# EAGLE design EARS (EAGLE 9.4.2)
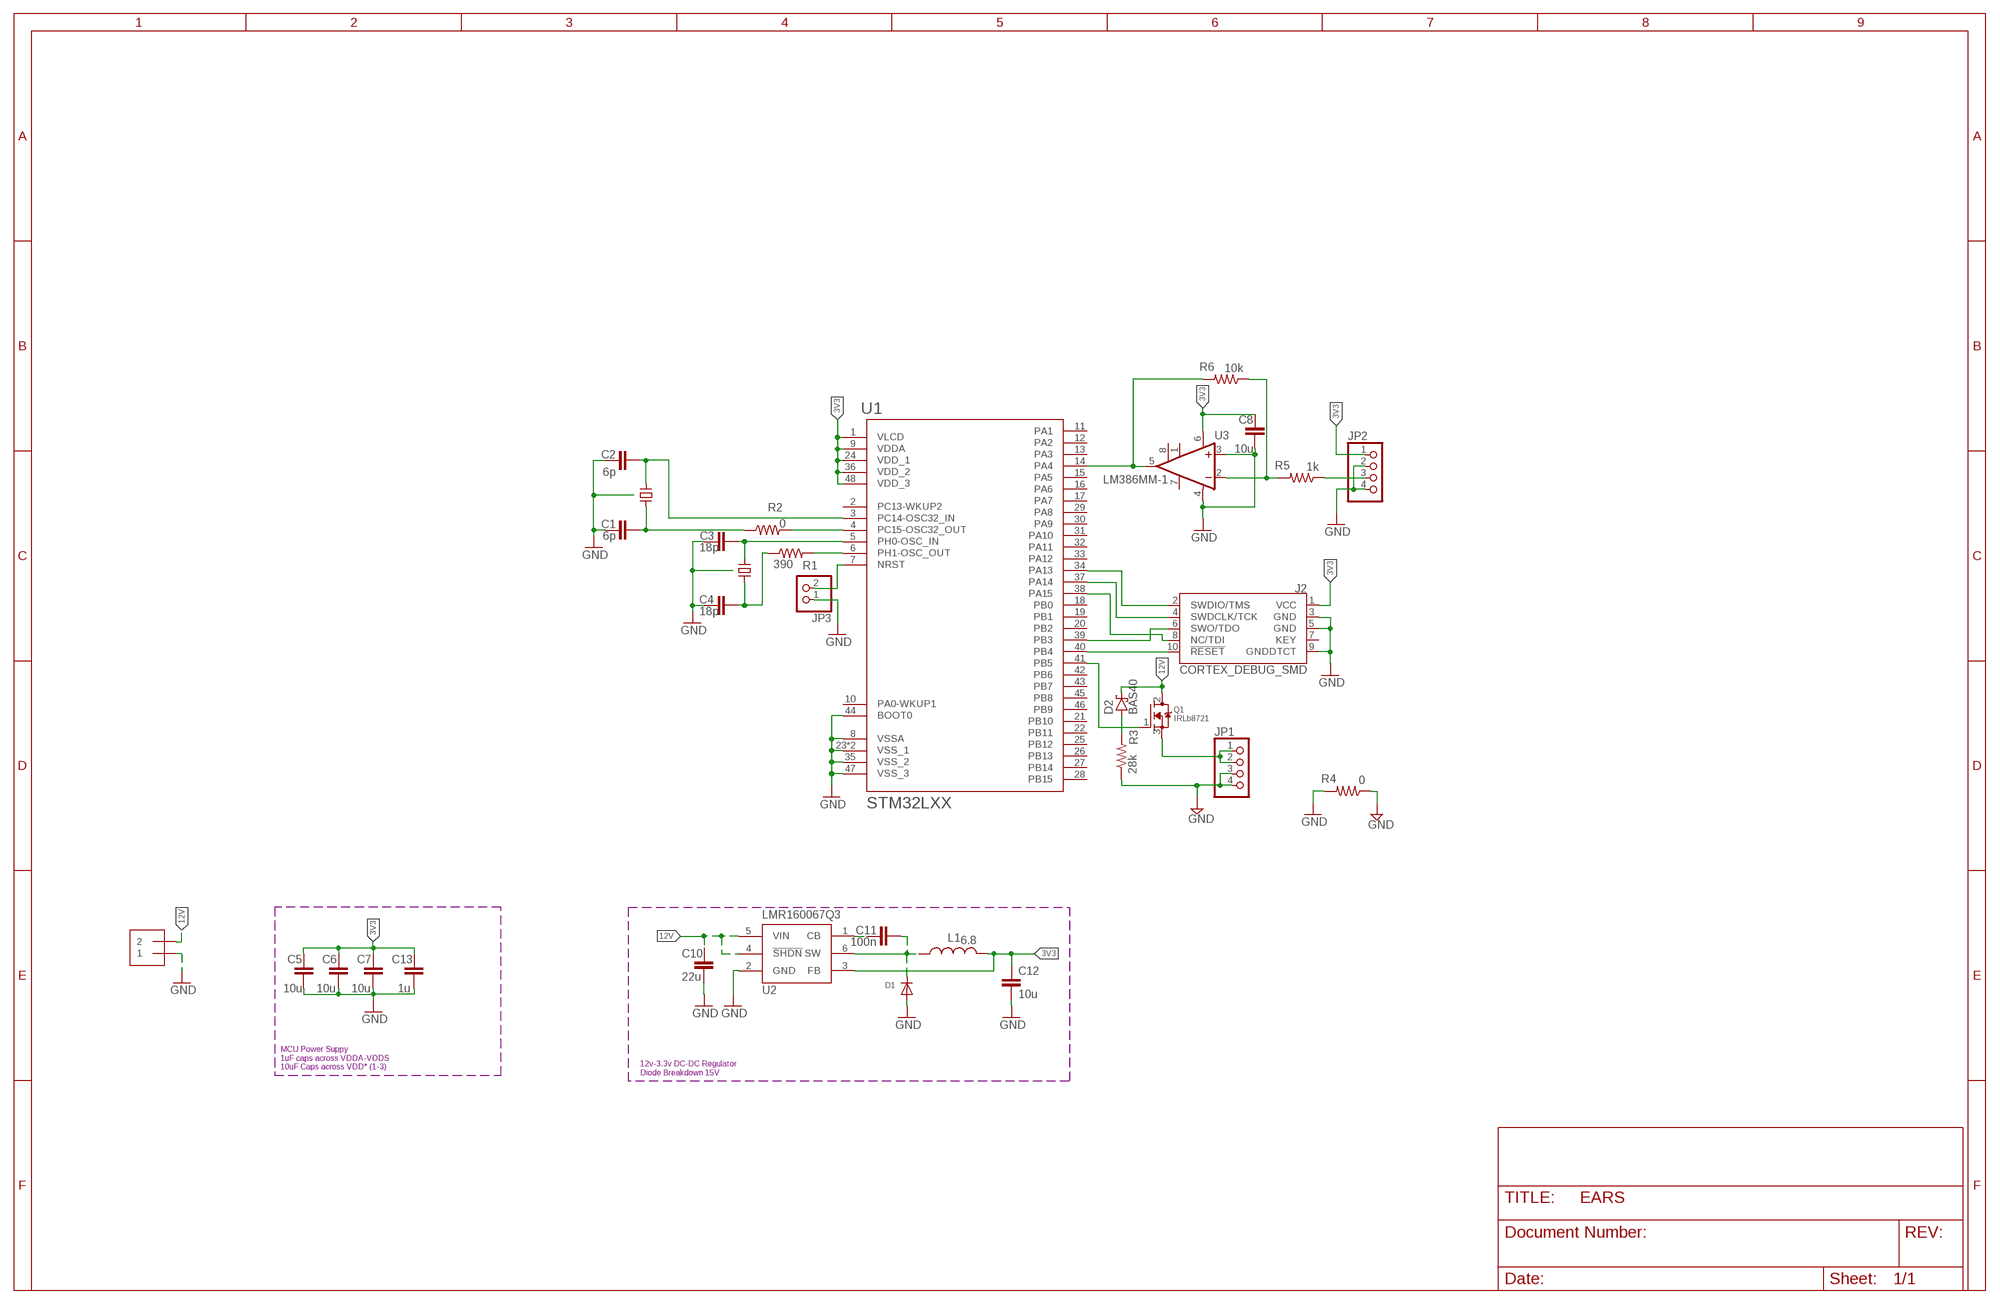
[diagram p0: schematic, sheet 1]

## Parts
C1  6p  C-EUC0603  [C0603]
C2  6p  C-EUC0603  [C0603]
C3  18p  C-EUC0603  [C0603]
C4  18p  C-EUC0603  [C0603]
C5  10u  C-EUC0603  [C0603]
C6  10u  C-EUC0603  [C0603]
C7  10u  C-EUC0603  [C0603]
C8  10u  C-EUC0603  [C0603]
C10  22u  C-EUC0603  [C0603]
C11  100n  C-EUC0603  [C0603]
C12  10u  C-EUC0603  [C0603]
C13  1u  C-EUC0603  [C0603]
D1  DIODESMA  [SMADIODE]
D2  BAS40  [SOT23]
J1  1X2-3.5MM  [1X2-3.5MM]
J2  CORTEX_DEBUG_SMD  [SAMTECH_FTSH-105-01]
JP1  PINHD-1X4  [1X04]
JP2  PINHD-1X4  [1X04]
JP3  PINHD-1X2  [1X02]
L1  6.8  L-USL3216C  [L3216C]
Q1  IRLb8721  MOSFET-NGDS_TO220V  [TO220V]
R1  390  R-US_R0603  [R0603]
R2  0  R-US_R0603  [R0603]
R3  28k  R-US_R0603  [R0603]
R4  0  R-US_R0603  [R0603]
R5  1k  R-US_R0603  [R0603]
R6  10k  R-US_R0603  [R0603]
U1  STM32LXX  [UFQFPN48]
U2  LMR160067Q3  [TI_SOT6]
U3  LM386MM-1  [MMSOP08]
X1  ECX_34G  [3.2X1.5_SC]
X2  FL0800011Q  [3.2X2.5_SSC]

## Nets
3V3: C5.2 C6.2 C7.2 C8.2 C12.1 C13.2 J2.1(VCC) JP2.1 L1.2 U1.1(VLCD) U1.9(VDDA) U1.24(VDD_1) U1.36(VDD_2) U1.48(VDD_3) U2.3(FB) U3.6(VS)
8M0X_OUT: C4.2 R1.1 X2.3(C2)
8MOX_IN: C3.2 U1.5(PH0-OSC_IN) X2.1(C1)
12V: C10.2 D2.3(C) J1.2 Q1.2(D) U2.4(!SHDN!) U2.5(VIN)
!RESET!: J2.10(!RESET) U1.40(PB4)
AGND: JP1.3 JP1.4 R3.1 R4.1 ; supply symbol labelled GND
FB: R5.2 R6.1 U3.2(-IN)
FLYBACK: D2.1(A) R3.2
GND: C1.1 C2.1 C3.1 C4.1 C5.1 C6.1 C7.1 C8.1 C10.1 C12.2 C13.1 D1.A J1.1 J2.3(GND) J2.5(GND) J2.9(GNDDTCT) JP2.2 JP2.4 JP3.1 R4.2 U1.8(VSSA) U1.23(VSS_1) U1.35(VSS_2) U1.44(BOOT0) U1.47(VSS_3) U1.T1(VSS_1) U2.2(GND) U3.3(+IN) U3.4(GND) X1.GND X2.2 X2.4
LMR_CB: C11.1 U2.1(CB)
LMR_SW: C11.2 D1.C L1.1 U2.6(SW)
MCU_P4: R2.2 U1.4(PC15-OSC32_OUT)
MCU_P6: R1.2 U1.6(PH1-OSC_OUT)
NC: J2.8(NC/TDI) U1.38(PA15)
NPN: JP1.1 JP1.2 Q1.3(S)
NPN_DRV: Q1.1(G) U1.41(PB5)
NRST: JP3.2 U1.7(NRST)
OSC32_IN: C1.2 R2.1 X1.C2
OSC32_OUT: C2.2 U1.3(PC14-OSC32_IN) X1.C1
PRESSURE: R6.2 U1.14(PA4) U3.5(OUT)
PRSR_IN: JP2.3 R5.1
SWDCLK: J2.4(SWDCLK/TCK) U1.37(PA14)
SWDIO: J2.2(SWDIO/TMS) U1.34(PA13)
SWO: J2.6(SWO/TDO) U1.39(PB3)
Unconnected: J2.7(KEY) U1.2(PC13-WKUP2) U1.10(PA0-WKUP1) U1.11(PA1) U1.12(PA2) U1.13(PA3) U1.15(PA5) U1.16(PA6) U1.17(PA7) U1.18(PB0) U1.19(PB1) U1.20(PB2) U1.21(PB10) U1.22(PB11) U1.25(PB12) U1.26(PB13) U1.27(PB14) U1.28(PB15) U1.29(PA8) U1.30(PA9) U1.31(PA10) U1.32(PA11) U1.33(PA12) U1.42(PB6) U1.43(PB7) U1.45(PB8) U1.46(PB9) U3.1(GAIN) U3.7(BYPASS) U3.8(GAIN)

## Notes on the sheet
- MCU Power Suppy
  1uF caps across VDDA-VDDS
  10uF Caps across VDD* (1-3)
- 12v-3.3v DC-DC Regulator
  Diode Breakdown 15V

## Library data of the parts
C1-C8 C10-C13 = rcl:C-EU: CAPACITOR, European symbol; SPICEPREFIX: C
D1 = adafruit:DIODE: Diode SMADIODE - SMA Surface Mount Package 20V 1A Schottky Diode Digikey: 641-1014-6-ND DO-1N4148 - Through Hole Small Current Diode SOD-123 20V 1 A (.5mV Vf) Schottky Diode - Digikey: MBRX120TPMSCT-ND SOD-323 10V 570mA (.38mV Vf, 3ns) Schottky Diode - Digikey: ZLLS410CT-ND SOD-523 30V 30mA Schottky Diode (RB751S-40TE61) - Digikey: RB751S-40TE61CT-ND SOT23-R/W - SOT23 Package (R = Solder Paste/Reflow Ovens, W = Hand-Soldering) BAT54Film 40V 300mA - Digikey: 497-7162-1-ND
D2 = diode:BAS40: Silicon Schottky Diodes General-purpose diode for high-speed switching
J1 = adafruit:1X2: 3.5mm Terminal block http://www.ladyada.net/library/pcb/eaglelibrary.html
J2 = SparkFun-Connectors:CORTEX_DEBUG: Cortex Debug Connector - 10 pin Supports JTAG debug, Serial Wire debug, and Serial Wire Viewer. PTH and SMD connector options available. General Connector Information <http://infocenter.arm.com/help/topic/com.arm.doc.faqs/attached/13634/cortex_debug_connectors.pdf> Products: PTH Connector <http://www.digikey.com/product-detail/en/cnc-tech/3220-10-0100-00/1175-1627-ND/3883661> -via Digi-Key SparkFun PSoc <https://www.sparkfun.com/products/13229> SparkFun T <https://www.sparkfun.com/products/13810>
JP1 JP2 = pinhead:PINHD-1X4: PIN HEADER
JP3 = pinhead:PINHD-1X2: PIN HEADER
L1 = rcl:L-US: INDUCTOR, American symbol; SPICEPREFIX: L
Q1 = adafruit:MOSFET-N: N-Channel Mosfet 2N7002E - 60V 260mA SOT23 [Digikey: 2N7002ET1GOSTR-ND] - REEL BSH103 - 30V 850mA SOT23 [Digikey: 568-5013-1-ND]
R1-R6 = rcl:R-US_: RESISTOR, American symbol; SPICEPREFIX: R
U1 = EARS:STM32LXX
U2 = EARS:LMR160067Q3
U3 = linear:LM386?-*: Low Voltage Audio Power Amplifier Source: http://cache.national.com/ds/LM/LM386.pdf
X1 = EARS:ECX_34G
X2 = EARS:FL0800011Q

## Board
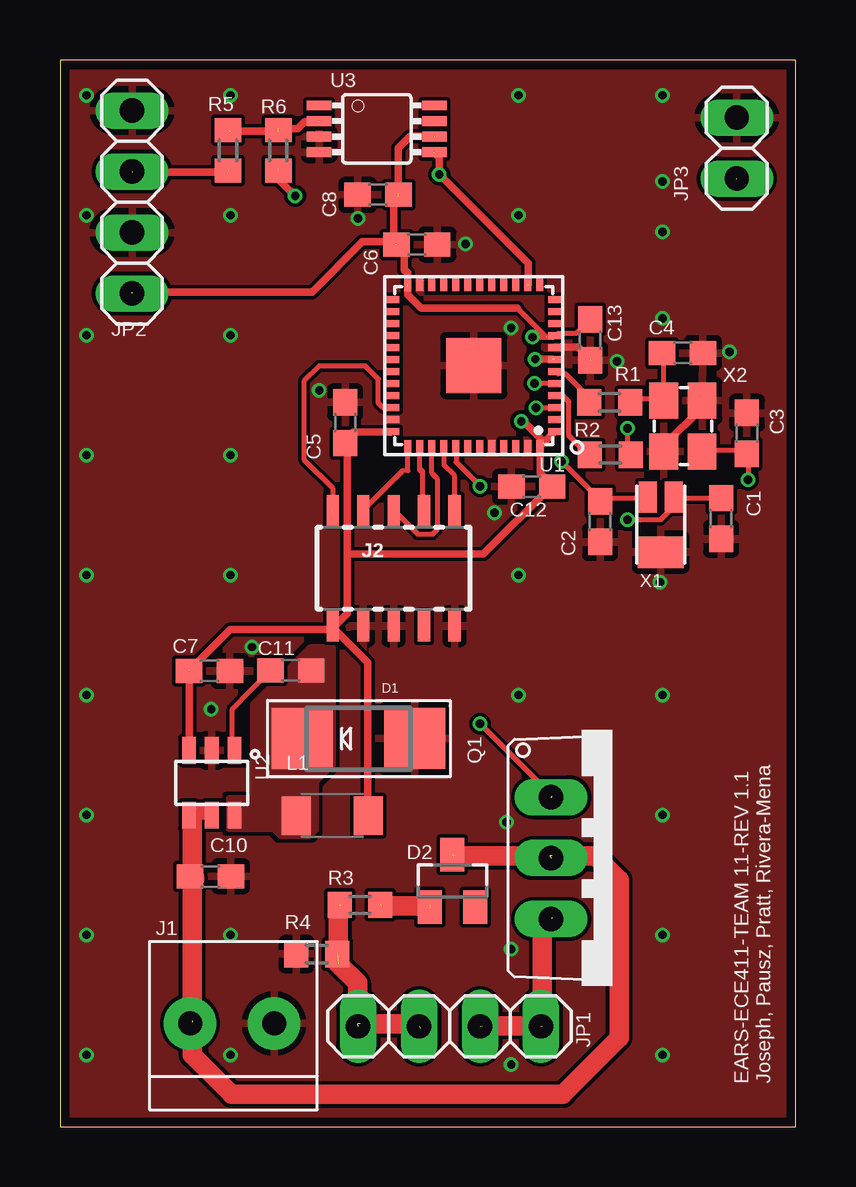
[diagram p1: board, top side]
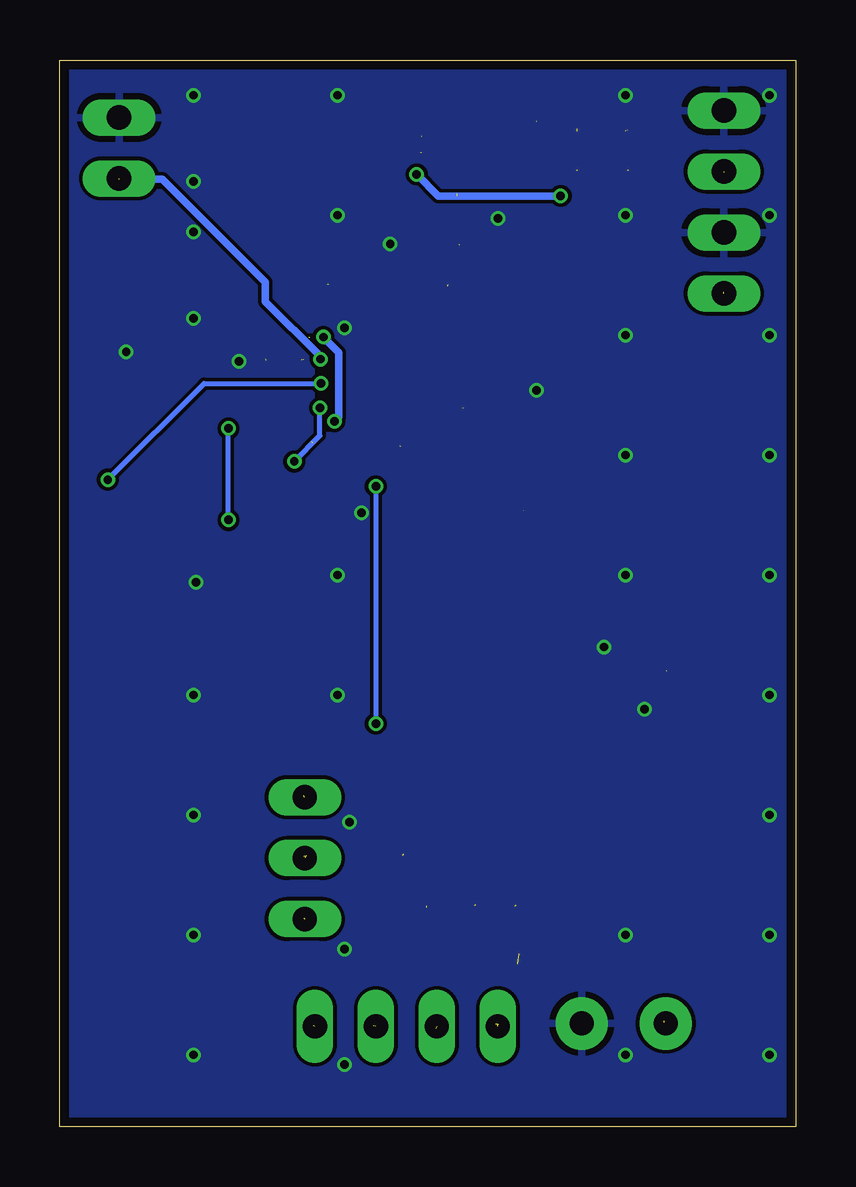
[diagram p2: board, bottom side, seen from below]

Size 30.66 x 44.47 mm. Coordinates in mm from the lower left corner, seen from the top.
Outline: 0,0 30.66,0 30.66,44.47 0,44.47 0,0
Copper layers (1*16): Top 0.035559375mm / dielectric 1.6mm / Bottom 0.035559375mm
Design rules "oshpark2layer": minimum track width 6mil, minimum drill 10mil, track to track 6mil, track to pad 6mil, pad to pad 6mil, via to via 6mil, smd to smd 6mil, copper to edge 15mil, drill to drill 6mil, minimum pad ring 5mil, minimum via ring 5mil, stop-mask expansion 2.5mil, vias tented up to drill 0mil, thermal gap 10mil

### Footprints (pad centres in the part's own frame; a part is rotated, then mirrored left to right if it is on the bottom)
C0603 = smd 1.1 x 1: 1 -0.85,0; 2 0.85,0
SMADIODE = smd 2.54 x 2.54: A 2.349,0; C -2.349,0
SOT23 = smd 1 x 1.4: 1 -0.95,-1.1; 2 0.95,-1.1; 3 0,1.1
1X2-3.5MM = drill 1 pad 2.184: 1 1.8,0; 2 -1.7,0
SAMTECH_FTSH-105-01 = smd 0.508 x 1.27: 1 -2.54,-2.413; 2 -2.54,2.413; 3 -1.27,-2.413; 4 -1.27,2.413; 5 0,-2.413; 6 0,2.413; 7 1.27,-2.413; 8 1.27,2.413; 9 2.54,-2.413; 10 2.54,2.413
1X04 = drill 1.016 long: 1 -3.81,0; 2 -1.27,0; 3 1.27,0; 4 3.81,0
1X02 = drill 1.016 long: 1 -1.27,0; 2 1.27,0
L3216C = smd 1.2 x 1.6: 1 -1.5,0; 2 1.5,0
TO220V = drill 1.016 long: 1 -2.54,-2.54; 2 0,-2.54; 3 2.54,-2.54
R0603 = smd 1 x 1.1: 1 -0.85,0; 2 0.85,0
UFQFPN48 = smd 0.55 x 0.3: 1 -3.375,2.75; 2 -3.375,2.25; 3 -3.375,1.75; 4 -3.375,1.25; 5 -3.375,0.75; 6 -3.375,0.25; 7 -3.375,-0.25; 8 -3.375,-0.75; 9 -3.375,-1.25; 10 -3.375,-1.75; 11 -3.375,-2.25; 12 -3.375,-2.75; 25 3.375,-2.75; 26 3.375,-2.25; 27 3.375,-1.75; 28 3.375,-1.25; 29 3.375,-0.75; 30 3.375,-0.25; 31 3.375,0.25; 32 3.375,0.75; 33 3.375,1.25; 34 3.375,1.75; 35 3.375,2.25; 36 3.375,2.75 | smd 0.3 x 0.55: 13 -2.75,-3.375; 14 -2.25,-3.375; 15 -1.75,-3.375; 16 -1.25,-3.375; 17 -0.75,-3.375; 18 -0.25,-3.375; 19 0.25,-3.375; 20 0.75,-3.375; 21 1.25,-3.375; 22 1.75,-3.375; 23 2.25,-3.375; 24 2.75,-3.375; 37 2.75,3.375; 38 2.25,3.375; 39 1.75,3.375; 40 1.25,3.375; 41 0.75,3.375; 42 0.25,3.375; 43 -0.25,3.375; 44 -0.75,3.375; 45 -1.25,3.375; 46 -1.75,3.375; 47 -2.25,3.375; 48 -2.75,3.375 | smd 2.3 x 2.3: T1 0,0
TI_SOT6 = smd 1.1 x 0.6: 1 -1.35,0.95; 2 -1.35,0; 3 -1.35,-0.95; 4 1.35,-0.95; 5 1.35,0; 6 1.35,0.95
MMSOP08 = smd 0.41 x 1.02: 1 -0.975,-2.4; 2 -0.325,-2.4; 3 0.325,-2.4; 4 0.975,-2.4; 5 0.975,2.4; 6 0.325,2.4; 7 -0.325,2.4; 8 -0.975,2.4
3.2X1.5_SC = smd 1.3 x 0.75: C1 -1.15,-0.55; C2 -1.15,0.55 | smd 1.3 x 1.9: GND 1.15,0
3.2X2.5_SSC = smd 1.5 x 1.2: 1 -1.06,-0.8; 2 1.06,-0.8; 3 1.06,0.8; 4 -1.06,0.8

### Placement (x,y rotation side)
C1  27.55,25.36 90 top
C2  22.51,25.23 90 top
C3  28.62,28.91 270 top
C4  25.94,32.26 180 top
C5  11.88,29.35 270 top
C6  14.87,36.78 180 top
C7  6.23,19.01 180 top
C8  13.25,38.85 0 top
C10  6.27,10.44 180 top
C11  9.62,19.02 0 top
C12  19.66,26.68 180 top
C13  22.09,32.8 90 top
D1  12.44,16.18 0 top
D2  16.35,10.25 0 top
J1  7.12,4.31 0 top
J2  13.9,23.28 0 top
JP1  16.23,4.19 180 top
JP2  3,38.55 90 top
JP3  28.2,40.8 270 top
L1  11.34,12.97 0 top
Q1  23,11.2 270 top
R1  22.9,30.2 180 top
R2  22.93,28.02 180 top
R3  12.5,9.25 0 top
R4  10.7,7.2 180 top
R5  7,40.7 90 top
R6  9.1,40.7 270 top
U1  17.24,31.73 180 top
U2  6.32,14.34 270 top
U3  13.2,41.6 270 top
X1  25.03,25.1 270 top
X2  25.95,29.21 90 top

### Tracks (layer width: path | path; a pad name or v marks a point on that pad's centre or on a via)
3V3  (via drill 0.35)  (9 unrouted)
  Top 0.152: 14.34,36.42 14.04,36.73 C6.2 | 21.96,33.53 C13.2 | 20.59,28.96 U1.1 | 20.01,28.35 U1.48 | 20.44,26.82 C12.1 20.44,26.67 | 20.59,32.92 U1.9 | 13.79,28.97 U1.36 | 11.91,28.65 C5.2 | 5.38,15.69 U2.3 | 11.3,20.73 J2.1 | 11.45,20.88 J2.1 | 12.82,13.11 L1.2 | 11.45,20.73 J2.1
  Top 0.203: 21.96,33.53 21.51,33.07 20.75,33.07 U1.9 | v19.69,32.92 20.26,32.92 19.06,34.12 | 20.29,32.92 20.59,32.92
  Top 0.305: 14.34,36.42 14.34,35.7 14.49,35.6 U1.24 | 20.59,28.96 20.18,28.54 19.3,29.42 v19.22,29.42 | 20.01,28.35 20.01,27.26 20.44,26.82 | 20.14,28.5 U1.48 | 14.5,35.05 14.5,34.69 15.06,34.12 19.06,34.12 | 13.79,28.97 12.22,28.97 11.91,28.65 | 5.38,15.69 C7.2 7.1,20.73 11.3,20.73 | 11.97,23.87 11.97,21.4 11.45,20.88 | 11.97,23.87 11.97,28.5 C5.2 | 12.82,13.11 12.82,19.36 11.45,20.73 | 20.44,26.67 17.64,23.87 11.97,23.87 | 14.1,38.9 14.1,40.8 14.6,41.3 15.6,41.3 | 3,34.8 10.5,34.8 12.6,36.9 13.9,36.9 | 13.9,36.9 14,36.8 | 14.1,38.8 13.9,38.6 13.9,36.9
  Bottom 0.305: v19.69,32.92 19.05,32.28 19.05,29.59 v19.22,29.42
8M0X_OUT
  Top 0.152: 25.01,30.33 X2.3 25.16,30.33
  Top 0.203: 25.01,30.33 23.79,30.33 R1.1 | 25.16,30.33 25.16,32.16 C4.2
8MOX_IN  (via drill 0.35)
  Top 0.152: U1.5 | 28.67,28.04 C3.2 28.52,28.19 | 26.84,28.19 X2.1
  Top 0.203: U1.5 v19.78,30.99 | 28.67,28.04 v28.67,26.98 | 28.52,28.19 26.84,28.19
  Bottom 0.203: v19.78,30.99 24.66,30.99 v28.67,26.98
12V  (4 unrouted)
  Top 0.152: 5.5,13.11 U2.4 5.5,12.95 | 6.27,13.11 U2.5 | 5.5,10.52 C10.2 | 5.5,4.42 J1.2
  Top 0.61: 6.27,13.11 5.5,13.11
  Top 0.813: 5.5,12.95 5.5,10.52 | 5.5,4.42 5.5,10.36 | 5.5,4.35 5.5,3 7.15,1.35 20.95,1.35 23.3,3.7 23.3,10.3 22.3,11.3 20.5,11.3 | 16.4,11.3 20.4,11.3
  Top 1.016: 5.5,10.36 C10.2
!RESET!
  Top 0.152: 16.02,28.35 U1.40
  Top 0.203: 16.02,28.35 16.02,27.56 16.44,27.14 J2.10
AGND  (5 unrouted)
  Top 0.813: 11.7,9.2 11.6,9.1 11.6,6.8 12.4,6 12.4,4.3 | 12.5,4.3 14.8,4.3 15,4.1
FB  (4 unrouted)
  Top 0.305: 7.1,41.5 9.1,41.5 | 9.1,41.6 9.9,41.6 10.2,41.9 10.8,41.9
FLYBACK  (2 unrouted)
  Top 0.813: 13.4,9.2 15.4,9.2
GND  (via drill 0.35)  (1 unrouted)
  Top 0.305: 25.17,28.41 26.75,29.99 | 20.6,32.5 21.6,32.5 22.1,32 22.1,31.9
  Top 0.406: 25.17,28.16 25.17,28.41
  other vias: 10.8,30.7 12.41,37.87 16.9,36.8 23.2,31.9 27.9,32.3 25,22.7 18.1,25.6 8,20 6.3,17.4 1.1,23 7.1,23 19.1,23 1.1,38 7.1,38 19.1,38 25.1,37.3 1.1,33 7.1,33 18.8,33.3 25.1,33.7 1.1,28 7.1,28 1.1,18 19.1,18 25.1,18 1.1,13 18.6,12.7 25.1,13 1.1,8 7.1,8 18.8,7.4 25.1,8 1.1,3 7.1,3 18.8,2.6 25.1,3 1.1,43 7.1,43 19.1,43 25.1,43 25.1,39.4
  pour Top (rank 3): 0,44.5 30.5,44.5 30.5,0 0,0
  pour Bottom: 0,44.5 0,0 30.5,0 30.5,44.5
LMR_CB
  Top 0.152: 7.18,15.7 U2.1
  Top 0.203: 7.18,15.7 7.18,17.4 C11.1
LMR_SW
  Top 0.152: 7.33,13.11 U2.6 | 9.77,13.11 L1.1 9.93,13.11 | 9.48,17.36 9.98,16.86 D1.C 9.95,16.32 9.93,16.46
  pour Top (no thermals): 7,12.4 8.9,12.4 9.2,12.1 10.4,12.1 10.7,12.4 10.7,14.4 11.4,15.1 11.4,20 10.4,20 8,17.6 8,13.8 7.9,13.7 7,13.7
MCU_P4
  Top 0.152: 21.96,28.04 R2.2
  Top 0.203: U1.4 20.95,30.48 21.2,30.23 21.2,28.8 21.96,28.04
MCU_P6
  Top 0.152: 20.75,31.39 U1.6
  Top 0.203: 20.75,31.39 21.05,31.39 22.12,30.33 R1.2
NC
  Top 0.152: 15.11,25.76 J2.8
  Top 0.203: 15.11,25.76 15.11,27.35 14.99,27.36 U1.38
NPN  (3 unrouted)
  Top 0.813: 20.5,8.7 20.1,8.3 20.1,4.2 17.6,4.2
NPN_DRV  (via drill 0.35)  (2 unrouted)
  Top 0.203: 16.5,28.4 16.5,27.7 v17.5,26.7 | v17.5,16.8 20.5,13.8
  Bottom 0.203: v17.5,26.7 v17.5,16.8
NRST  (via drill 0.35)  (2 unrouted)
  Top 0.305: 20.5,32 v19.8,32
  Bottom 0.305: v19.8,32 19.8,32.1 22.1,34.4 22.1,35.2 26.4,39.5 28.2,39.5
OSC32_IN  (via drill 0.35)
  Top 0.152: 25.47,25.76 25.47,26.21 X1.C2 25.62,26.21 | 23.64,28.04 R2.1 | 27.45,26.21 C1.2
  Top 0.203: v23.64,29.11 23.64,28.04 | v23.64,25.3 25.01,25.3 25.47,25.76 | 25.62,26.21 27.45,26.21
  Bottom 0.203: v23.64,25.3 v23.64,29.11
OSC32_OUT  (via drill 0.35)
  Top 0.152: U1.3 | 24.4,26.21 X1.C1 | 22.57,26.21 C2.2
  Top 0.203: v19.83,29.97 U1.3 | v20.9,27.74 22.42,26.21 C2.2 | 22.57,26.21 24.4,26.21
  Bottom 0.203: v19.83,29.97 19.83,28.81 v20.9,27.74
PRESSURE  (via drill 0.35)  (3 unrouted)
  Top 0.305: 15.6,40.6 15.8,40.4 v15.8,39.7 19.5,36 U1.14 | 9.1,39.9 9.1,39.5 v9.8,38.8
  Bottom 0.305: v9.8,38.8 14.9,38.8 v15.8,39.7
PRSR_IN  (2 unrouted)
  Top 0.305: 3,39.8 6.9,39.8 7,39.9
SWDCLK
  Top 0.152: 12.67,25.76 J2.4
  Top 0.203: 12.67,25.76 14.25,27.34 14.49,27.36 U1.37
SWDIO  (2 unrouted)
  Top 0.203: U1.34 13.45,29.98 13.27,30.16 13.27,31.17 12.72,31.72 10.8,31.72 10.16,31.08 10.16,27.82 11.36,26.62 J2.2
SWO
  Top 0.203: U1.39 15.49,27.25 15.72,27.03 15.72,24.89 15.52,24.7 14.9,24.7 13.92,25.68 J2.6

### Text on the board
tPlace: EARS-ECE411-TEAM 11-REV 1.1 / Joseph, Pausz, Pratt, Rivera-Mena